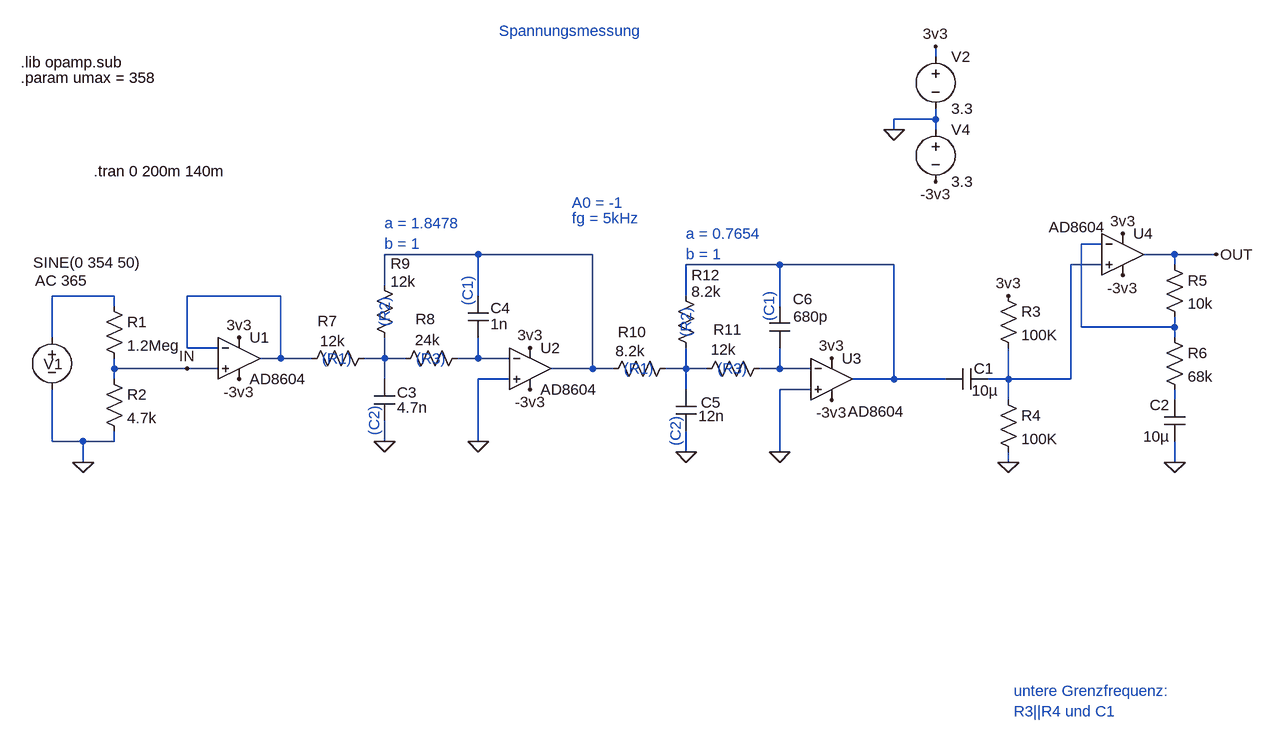
[diagram p0: schematic spannungsmessung_spice_transient.asc]
spannungsmessung_spice_transient.asc, the LTspice schematic file:
Version 4
SHEET 1 2304 1044
WIRE 1504 -288 1504 -304
WIRE 1504 -192 1504 -208
WIRE 1504 -192 1440 -192
WIRE 1440 -176 1440 -192
WIRE 1504 -176 1504 -192
WIRE 1760 0 1728 0
WIRE 800 16 656 16
WIRE 976 16 800 16
WIRE 1872 16 1824 16
WIRE 1936 16 1872 16
WIRE 1264 32 1120 32
WIRE 1440 32 1264 32
WIRE 1760 32 1712 32
WIRE 1872 32 1872 16
WIRE 656 64 656 16
WIRE 240 80 144 80
WIRE 496 80 352 80
WIRE 800 80 800 16
WIRE 1120 80 1120 32
WIRE 240 96 240 80
WIRE 1264 96 1264 32
WIRE 1728 128 1728 0
WIRE 1872 128 1872 112
WIRE 1872 128 1728 128
WIRE 144 144 144 80
WIRE 1872 144 1872 128
WIRE 352 160 352 80
WIRE 400 160 352 160
WIRE 496 176 496 80
WIRE 496 176 464 176
WIRE 544 176 496 176
WIRE 656 176 656 144
WIRE 656 176 624 176
WIRE 688 176 656 176
WIRE 800 176 800 144
WIRE 800 176 768 176
WIRE 848 176 800 176
WIRE 240 192 240 176
WIRE 352 192 240 192
WIRE 400 192 352 192
WIRE 976 192 976 16
WIRE 976 192 912 192
WIRE 1008 192 976 192
WIRE 1120 192 1120 160
WIRE 1120 192 1088 192
WIRE 1152 192 1120 192
WIRE 1264 192 1264 160
WIRE 1264 192 1232 192
WIRE 1312 192 1264 192
WIRE 240 208 240 192
WIRE 656 208 656 176
WIRE 848 208 800 208
WIRE 1440 208 1440 32
WIRE 1440 208 1376 208
WIRE 1520 208 1440 208
WIRE 1616 208 1616 160
WIRE 1616 208 1584 208
WIRE 1712 208 1712 32
WIRE 1712 208 1616 208
WIRE 1120 224 1120 192
WIRE 1312 224 1264 224
WIRE 1616 240 1616 208
WIRE 1872 240 1872 224
WIRE 144 304 144 224
WIRE 192 304 144 304
WIRE 240 304 240 288
WIRE 240 304 192 304
WIRE 656 304 656 272
WIRE 800 304 800 208
WIRE 1120 320 1120 288
WIRE 1264 320 1264 224
WIRE 192 336 192 304
WIRE 1616 336 1616 320
WIRE 1872 336 1872 304
FLAG 1616 336 0
FLAG 1504 -304 3v3
FLAG 1616 80 3v3
FLAG 1872 336 0
FLAG 192 336 0
FLAG 656 304 0
FLAG 800 304 0
FLAG 1120 320 0
FLAG 1264 320 0
FLAG 1440 -176 0
FLAG 1504 -96 -3v3
FLAG 432 144 3v3
FLAG 880 160 3v3
FLAG 1344 176 3v3
FLAG 1792 -16 3v3
FLAG 432 208 -3v3
FLAG 880 224 -3v3
FLAG 1344 240 -3v3
FLAG 1792 48 -3v3
FLAG 1936 16 OUT
FLAG 352 192 IN
SYMBOL voltage 144 128 R0
WINDOW 123 -26 -72 Left 2
WINDOW 39 0 0 Left 0
WINDOW 0 -13 57 Left 2
WINDOW 3 -29 -99 Left 2
SYMATTR Value2 AC 365
SYMATTR InstName V1
SYMATTR Value SINE(0 354 50)
SYMBOL res 224 80 R0
SYMATTR InstName R1
SYMATTR Value 1.2Meg
SYMBOL res 224 192 R0
SYMATTR InstName R2
SYMATTR Value 4.7k
SYMBOL cap 1584 192 R90
WINDOW 0 15 6 VBottom 2
WINDOW 3 18 4 VTop 2
SYMATTR InstName C1
SYMATTR Value 10µ
SYMBOL res 1600 64 R0
SYMATTR InstName R3
SYMATTR Value 100K
SYMBOL res 1600 224 R0
SYMATTR InstName R4
SYMATTR Value 100K
SYMBOL voltage 1504 -304 R0
WINDOW 123 0 0 Left 0
WINDOW 39 0 0 Left 0
SYMATTR InstName V2
SYMATTR Value 3.3
SYMBOL res 1856 16 R0
SYMATTR InstName R5
SYMATTR Value 10k
SYMBOL res 1856 128 R0
SYMATTR InstName R6
SYMATTR Value 68k
SYMBOL cap 1888 304 R180
WINDOW 0 24 56 Left 2
WINDOW 3 24 8 Left 2
SYMATTR InstName C2
SYMATTR Value 10µ
SYMBOL res 528 192 R270
WINDOW 0 58 40 VTop 2
WINDOW 3 58 48 VBottom 2
SYMATTR InstName R7
SYMATTR Value 12k
SYMBOL res 672 192 R270
WINDOW 0 61 47 VTop 2
WINDOW 3 60 50 VBottom 2
SYMATTR InstName R8
SYMATTR Value 24k
SYMBOL res 640 48 R0
WINDOW 0 25 -18 Left 2
WINDOW 3 25 10 Left 2
SYMATTR InstName R9
SYMATTR Value 12k
SYMBOL cap 640 208 R0
WINDOW 0 35 21 Left 2
WINDOW 3 35 44 Left 2
SYMATTR InstName C3
SYMATTR Value 4.7n
SYMBOL cap 784 80 R0
WINDOW 0 35 19 Left 2
WINDOW 3 35 43 Left 2
SYMATTR InstName C4
SYMATTR Value 1n
SYMBOL res 992 208 R270
WINDOW 0 57 45 VTop 2
WINDOW 3 59 42 VBottom 2
SYMATTR InstName R10
SYMATTR Value 8.2k
SYMBOL res 1136 208 R270
WINDOW 0 61 48 VTop 2
WINDOW 3 61 42 VBottom 2
SYMATTR InstName R11
SYMATTR Value 12k
SYMBOL res 1104 64 R0
WINDOW 0 24 -16 Left 2
WINDOW 3 24 9 Left 2
SYMATTR InstName R12
SYMATTR Value 8.2k
SYMBOL cap 1104 224 R0
WINDOW 0 39 20 Left 2
WINDOW 3 35 41 Left 2
SYMATTR InstName C5
SYMATTR Value 12n
SYMBOL cap 1248 96 R0
WINDOW 0 36 -11 Left 2
WINDOW 3 37 16 Left 2
SYMATTR InstName C6
SYMATTR Value 680p
SYMBOL voltage 1504 -192 R0
WINDOW 123 0 0 Left 0
WINDOW 39 0 0 Left 0
SYMATTR InstName V4
SYMATTR Value 3.3
SYMBOL Opamps\\AD8604 432 112 R0
SYMATTR InstName U1
SYMBOL Opamps\\AD8604 880 128 R0
SYMATTR InstName U2
SYMBOL Opamps\\AD8604 1344 144 R0
WINDOW 3 25 114 Left 2
SYMATTR InstName U3
SYMBOL Opamps\\AD8604 1792 -48 R0
WINDOW 3 -114 22 Left 2
SYMATTR InstName U4
TEXT 96 -280 Left 2 !.lib opamp.sub
TEXT 1624 688 Left 2 ;untere Grenzfrequenz:\nR3||R4 und C1
TEXT 656 -32 Left 2 ;a = 1.8478\nb = 1
TEXT 1120 -16 Left 2 ;a = 0.7654\nb = 1
TEXT 944 -64 Left 2 ;A0 = -1
TEXT 944 -40 Left 2 ;fg = 5kHz
TEXT 96 -256 Left 2 !.param umax = 358
TEXT 560 176 Left 2 ;(R1)
TEXT 656 80 VRight 2 ;(R2)
TEXT 704 176 Left 2 ;(R3)
TEXT 1024 192 Left 2 ;(R1)
TEXT 1120 96 VRight 2 ;(R2)
TEXT 1168 192 Left 2 ;(R3)
TEXT 640 248 VRight 2 ;(C2)
TEXT 784 48 VRight 2 ;(C1)
TEXT 1248 72 VRight 2 ;(C1)
TEXT 1104 264 VRight 2 ;(C2)
TEXT 832 -328 Left 2 ;Spannungsmessung
TEXT 208 -112 Left 2 !.tran 0 200m 140m

The netlist it stands for:
* spannungsmessung_spice_transient.asc
V1 N005 0 SINE(0 354 50) AC 365
R1 N005 IN 1.2Meg
R2 IN 0 4.7k
C1 N004 N003 10µ
R3 3v3 N004 100K
R4 N004 0 100K
V2 3v3 0 3.3
R5 OUT N001 10k
R6 N001 N011 68k
C2 0 N011 10µ
R7 N006 N007 12k
R8 N007 N008 24k
R9 N002 N007 12k
C3 N007 0 4.7n
C4 N002 N008 1n
R10 N002 N009 8.2k
R11 N009 N010 12k
R12 N003 N009 8.2k
C5 N009 0 12n
C6 N003 N010 680p
V4 0 -3v3 3.3
XU1 IN N006 3v3 -3v3 N006 AD8604  ; pins In+ In- V+ V- OUT
XU2 0 N008 3v3 -3v3 N002 AD8604  ; pins In+ In- V+ V- OUT
XU3 0 N010 3v3 -3v3 N003 AD8604  ; pins In+ In- V+ V- OUT
XU4 N004 N001 3v3 -3v3 OUT AD8604  ; pins In+ In- V+ V- OUT
.lib opamp.sub
* untere Grenzfrequenz:
* R3||R4 und C1
* a = 1.8478
* b = 1
* a = 0.7654
* b = 1
* A0 = -1
* fg = 5kHz
.param umax = 358
* (R1)
* (R2)
* (R3)
* (R1)
* (R2)
* (R3)
* (C2)
* (C1)
* (C1)
* (C2)
* Spannungsmessung
.tran 0 200m 140m
.backanno
.end